# EAGLE design breakout board (EAGLE 9.7.0)
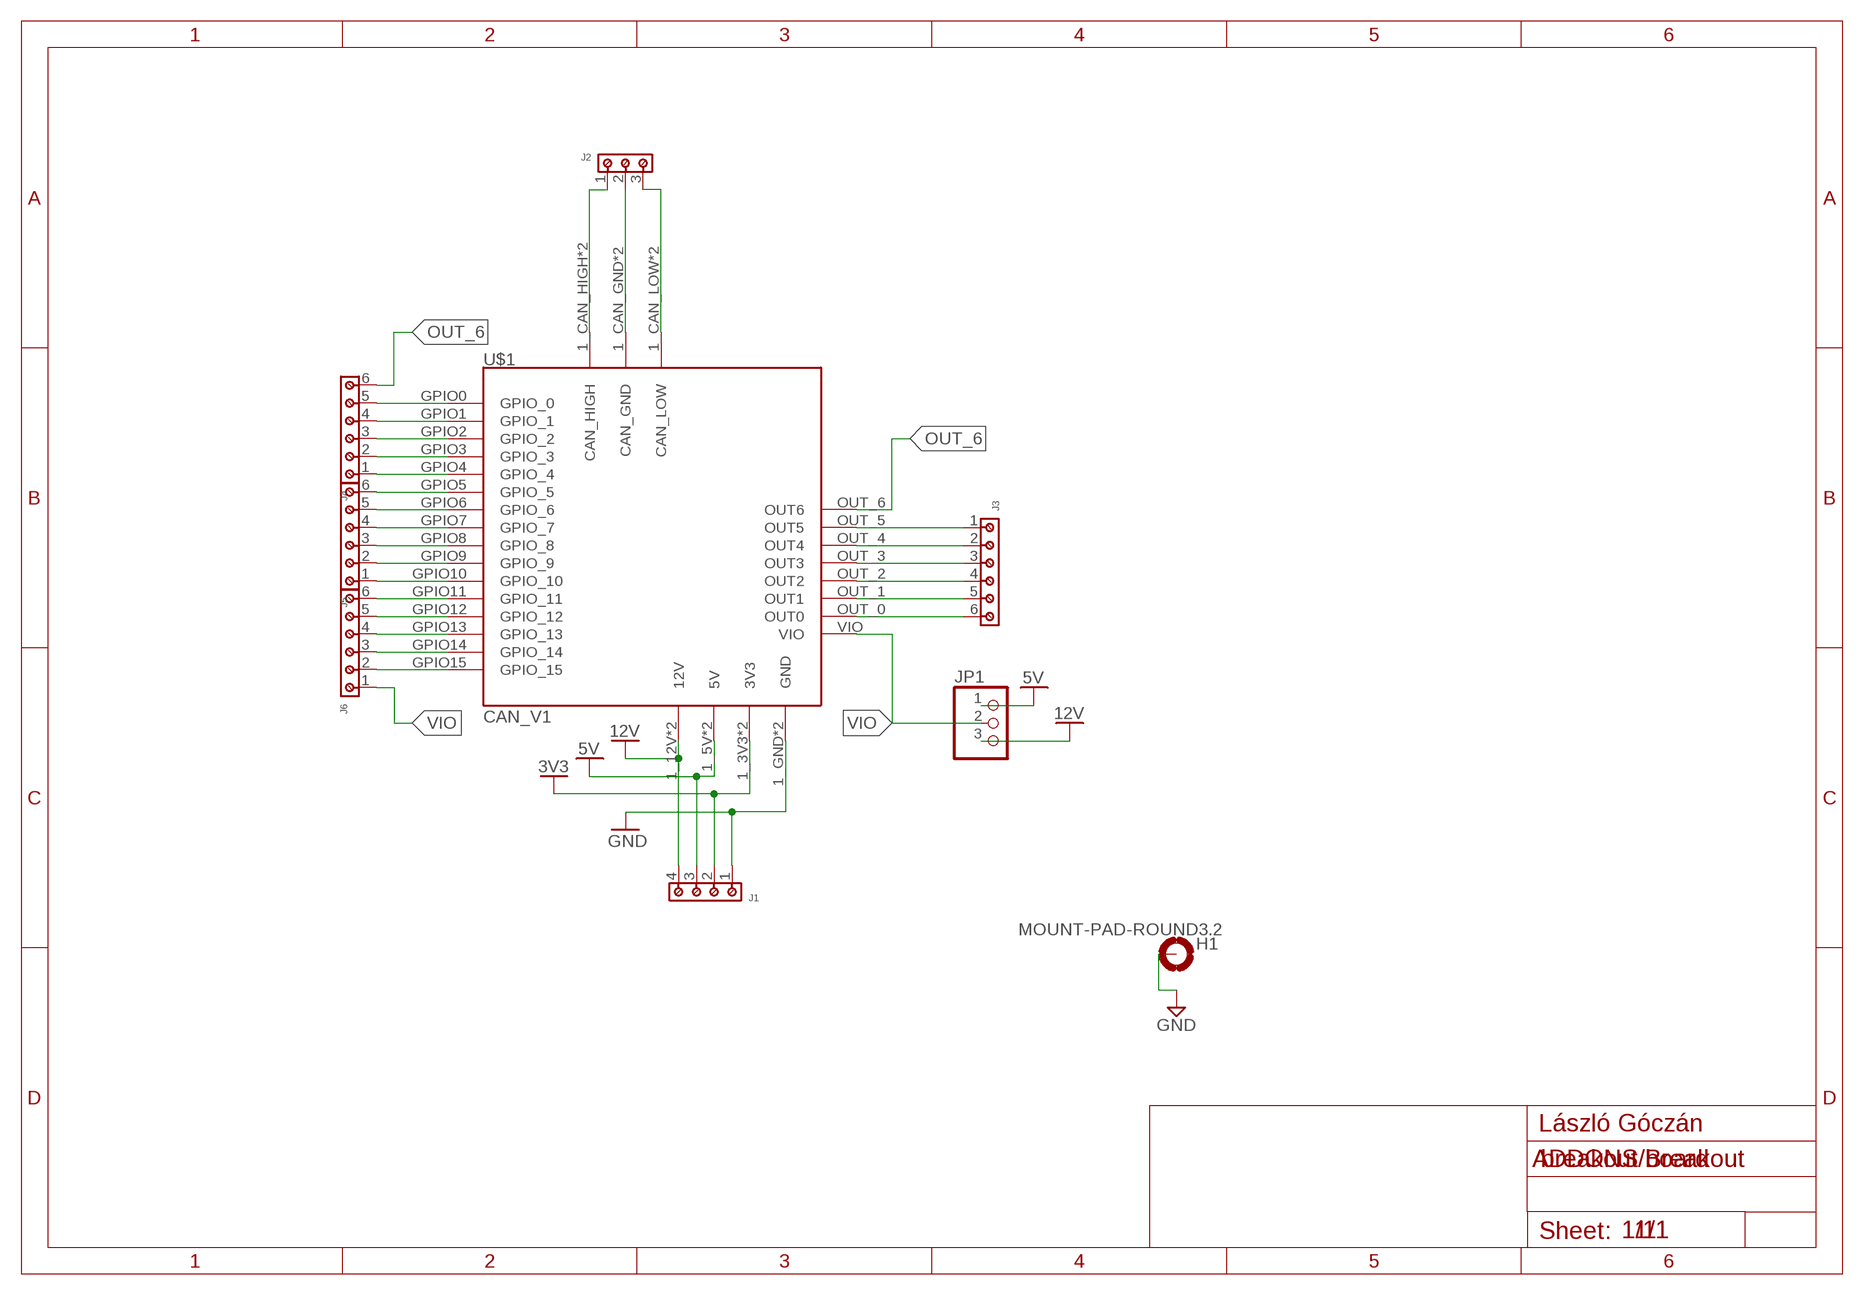
[diagram p0: schematic, sheet 1]

## Parts
H1  MOUNT-PAD-ROUND3.2  [3,2-PAD]
J1  691210910004  [691210910004]
J2  691210910003  [691210910003]
J3  691210910006  [691210910006]
J4  691210910006  [691210910006]
J5  691210910006  [691210910006]
J6  691210910006  [691210910006]
JP1  PINHD-1X3  [1X03]
U$1  CAN_V1  [CAN_V1]

## Nets
3V3: J1.2 U$1.1_3V3(3V3) U$1.2_3V3(3V3)
5V: J1.3 JP1.1 U$1.1_5V(5V) U$1.2_5V(5V)
12V: J1.4 JP1.3 U$1.1_12V(12V) U$1.2_12V(12V)
GND: H1.B3,2(MOUNT) J1.1 U$1.1_GND(GND) U$1.2_GND(GND)
N$1: J2.1 U$1.1_CAN_HIGH(CAN_HIGH) U$1.2_CAN_HIGH(CAN_HIGH)
N$2: J2.2 U$1.1_CAN_GND(CAN_GND) U$1.2_CAN_GND(CAN_GND)
N$3: J2.3 U$1.1_CAN_LOW(CAN_LOW) U$1.2_CAN_LOW(CAN_LOW)
N$4: J3.6 U$1.OUT_0(OUT0)
N$5: J3.5 U$1.OUT_1(OUT1)
N$6: J3.4 U$1.OUT_2(OUT2)
N$7: J3.3 U$1.OUT_3(OUT3)
N$8: J3.2 U$1.OUT_4(OUT4)
N$9: J3.1 U$1.OUT_5(OUT5)
N$10: J4.5 U$1.GPIO0(GPIO_0)
N$11: J4.4 U$1.GPIO1(GPIO_1)
N$12: J4.3 U$1.GPIO2(GPIO_2)
N$13: J4.2 U$1.GPIO3(GPIO_3)
N$14: J4.1 U$1.GPIO4(GPIO_4)
N$15: J5.6 U$1.GPIO5(GPIO_5)
N$16: J5.5 U$1.GPIO6(GPIO_6)
N$17: J5.4 U$1.GPIO7(GPIO_7)
N$18: J5.3 U$1.GPIO8(GPIO_8)
N$19: J5.2 U$1.GPIO9(GPIO_9)
N$20: J5.1 U$1.GPIO10(GPIO_10)
N$21: J6.6 U$1.GPIO11(GPIO_11)
N$22: J6.5 U$1.GPIO12(GPIO_12)
N$23: J6.4 U$1.GPIO13(GPIO_13)
N$24: J6.3 U$1.GPIO14(GPIO_14)
N$25: J6.2 U$1.GPIO15(GPIO_15)
OUT_6: J4.6 U$1.OUT_6(OUT6)
VIO: J6.1 JP1.2 U$1.VIO

## Notes on the sheet
- László Góczán
- ADDONS/Breakout
- 1/1

## Library data of the parts
H1 = holes:MOUNT-PAD-ROUND: MOUNTING PAD, round
J1 = Wurth_Connectors_WR-TBL Rising Cage Clamp:691210910004: WR-TBL Serie 2109 - 2.54 mm Horiz. Entry KIND PROPERTIES Pitch 2.54 mm MATERIAL PROPERTIES Insulator Material PA66 Insulator Flammability Rating UL94 V-0 Insulator Color Green Contact Material Brass Contact Plating Copper over Zinc Terminal Screw Material Steel Terminal Screw Plating Zinc Wire Guard Material Brass GENERAL INFORMATION Operating Temperature -40 up to +105 °C Compliance Lead free / RoHS ELECTRICAL PROPERTIES IR cULus 6 A Working Voltage [cULus] 150 V (AC) Withstanding Voltage [cULus] 1300 V (AC) Contact Resistance [cULus] 20 mΩ MECHANICAL PROPERTIES Wire Strip Length 4 up to 5 (mm) Screw M1.6 Solid Wire Section (AWG) 30 to 18 (AWG) Solid Wire Section (Metric) 0.0509 to 0.823 (mm²) Stranded Wire Section (AWG) 30 to 18 (AWG) Stranded Wire Section (Metric) 0.0509 to 0.823 (mm²) CERTIFICATION cULus Approval E315414 PACKAGING PROPERTIES Packaging Box <https://katalog.we-online.com/media/images/v2/o33231v209%20Family_WR-TBL_69121091000x.jpg> Details see: https://katalog.we-online.com/en/em/TBL_2_54_2109_HORIZONTAL_ENTRY_69121091000X Updated by Ella Wu 2019-11-12 2019(C) Wurth Elektronik; DATASHEET-URL: https://www.we-online.com/redexpert/spec/691210910004?ae; IR-UL: 6A; MOUNT: THT; PART-NUMBER: 691210910004; PINS: 4; PITCH: 2.54mm; TYPE: Horizontal; WIRE: 30 to 18 (AWG) 0.0509 to 0.823 (mm²); WORKING-VOLTAGE-UL: 150V (AC)
J2 = Wurth_Connectors_WR-TBL Rising Cage Clamp:691210910003: WR-TBL Serie 2109 - 2.54 mm Horiz. Entry KIND PROPERTIES Pitch 2.54 mm MATERIAL PROPERTIES Insulator Material PA66 Insulator Flammability Rating UL94 V-0 Insulator Color Green Contact Material Brass Contact Plating Copper over Zinc Terminal Screw Material Steel Terminal Screw Plating Zinc Wire Guard Material Brass GENERAL INFORMATION Operating Temperature -40 up to +105 °C Compliance Lead free / RoHS ELECTRICAL PROPERTIES IR cULus 6 A Working Voltage [cULus] 150 V (AC) Withstanding Voltage [cULus] 1300 V (AC) Contact Resistance [cULus] 20 mΩ MECHANICAL PROPERTIES Wire Strip Length 4 up to 5 (mm) Screw M1.6 Solid Wire Section (AWG) 30 to 18 (AWG) Solid Wire Section (Metric) 0.0509 to 0.823 (mm²) Stranded Wire Section (AWG) 30 to 18 (AWG) Stranded Wire Section (Metric) 0.0509 to 0.823 (mm²) CERTIFICATION cULus Approval E315414 PACKAGING PROPERTIES Packaging Box <https://katalog.we-online.com/media/images/v2/o33231v209%20Family_WR-TBL_69121091000x.jpg> Details see: https://katalog.we-online.com/en/em/TBL_2_54_2109_HORIZONTAL_ENTRY_69121091000X Updated by Ella Wu 2019-11-12 2019(C) Wurth Elektronik; DATASHEET-URL: https://www.we-online.com/redexpert/spec/691210910003?ae; IR-UL: 6A; MOUNT: THT; PART-NUMBER: 691210910003; PINS: 3; PITCH: 2.54mm; TYPE: Horizontal; WIRE: 30 to 18 (AWG) 0.0509 to 0.823 (mm²); WORKING-VOLTAGE-UL: 150V (AC)
J3-J6 = Wurth_Connectors_WR-TBL Rising Cage Clamp:691210910006: WR-TBL Serie 2109 - 2.54 mm Horiz. Entry KIND PROPERTIES Pitch 2.54 mm MATERIAL PROPERTIES Insulator Material PA66 Insulator Flammability Rating UL94 V-0 Insulator Color Green Contact Material Brass Contact Plating Copper over Zinc Terminal Screw Material Steel Terminal Screw Plating Zinc Wire Guard Material Brass GENERAL INFORMATION Operating Temperature -40 up to +105 °C Compliance Lead free / RoHS ELECTRICAL PROPERTIES IR cULus 6 A Working Voltage [cULus] 150 V (AC) Withstanding Voltage [cULus] 1300 V (AC) Contact Resistance [cULus] 20 mΩ MECHANICAL PROPERTIES Wire Strip Length 4 up to 5 (mm) Screw M1.6 Solid Wire Section (AWG) 30 to 18 (AWG) Solid Wire Section (Metric) 0.0509 to 0.823 (mm²) Stranded Wire Section (AWG) 30 to 18 (AWG) Stranded Wire Section (Metric) 0.0509 to 0.823 (mm²) CERTIFICATION cULus Approval E315414 PACKAGING PROPERTIES Packaging Box <https://katalog.we-online.com/media/images/v2/o33231v209%20Family_WR-TBL_69121091000x.jpg> Details see: https://katalog.we-online.com/en/em/TBL_2_54_2109_HORIZONTAL_ENTRY_69121091000X Updated by Ella Wu 2019-11-12 2019(C) Wurth Elektronik; DATASHEET-URL: https://www.we-online.com/redexpert/spec/691210910006?ae; IR-UL: 6A; MOUNT: THT; PART-NUMBER: 691210910006; PINS: 6; PITCH: 2.54mm; TYPE: Horizontal; WIRE: 30 to 18 (AWG) 0.0509 to 0.823 (mm²); WORKING-VOLTAGE-UL: 150V (AC)
JP1 = Connector:PINHD-1X3: PIN HEADER; CATEGORY: Headers; DESCRIPTION: Header, Straight, 3 Position; MANUFACTURER: Generic; MPN: Generic; OPERATING_TEMPERATURE: Generic; PART_STATUS: Active; PITCH: 0.100" (2.54mm); ROHS_COMPLIANCE: Generic; SERIES: Generic; SUB-CATEGORY: Headers, Male Pins; TYPE: Board to Board or Cable, Unshrouded, Through Hole, Straight
U$1 = solar_component:CAN_V1

## Board
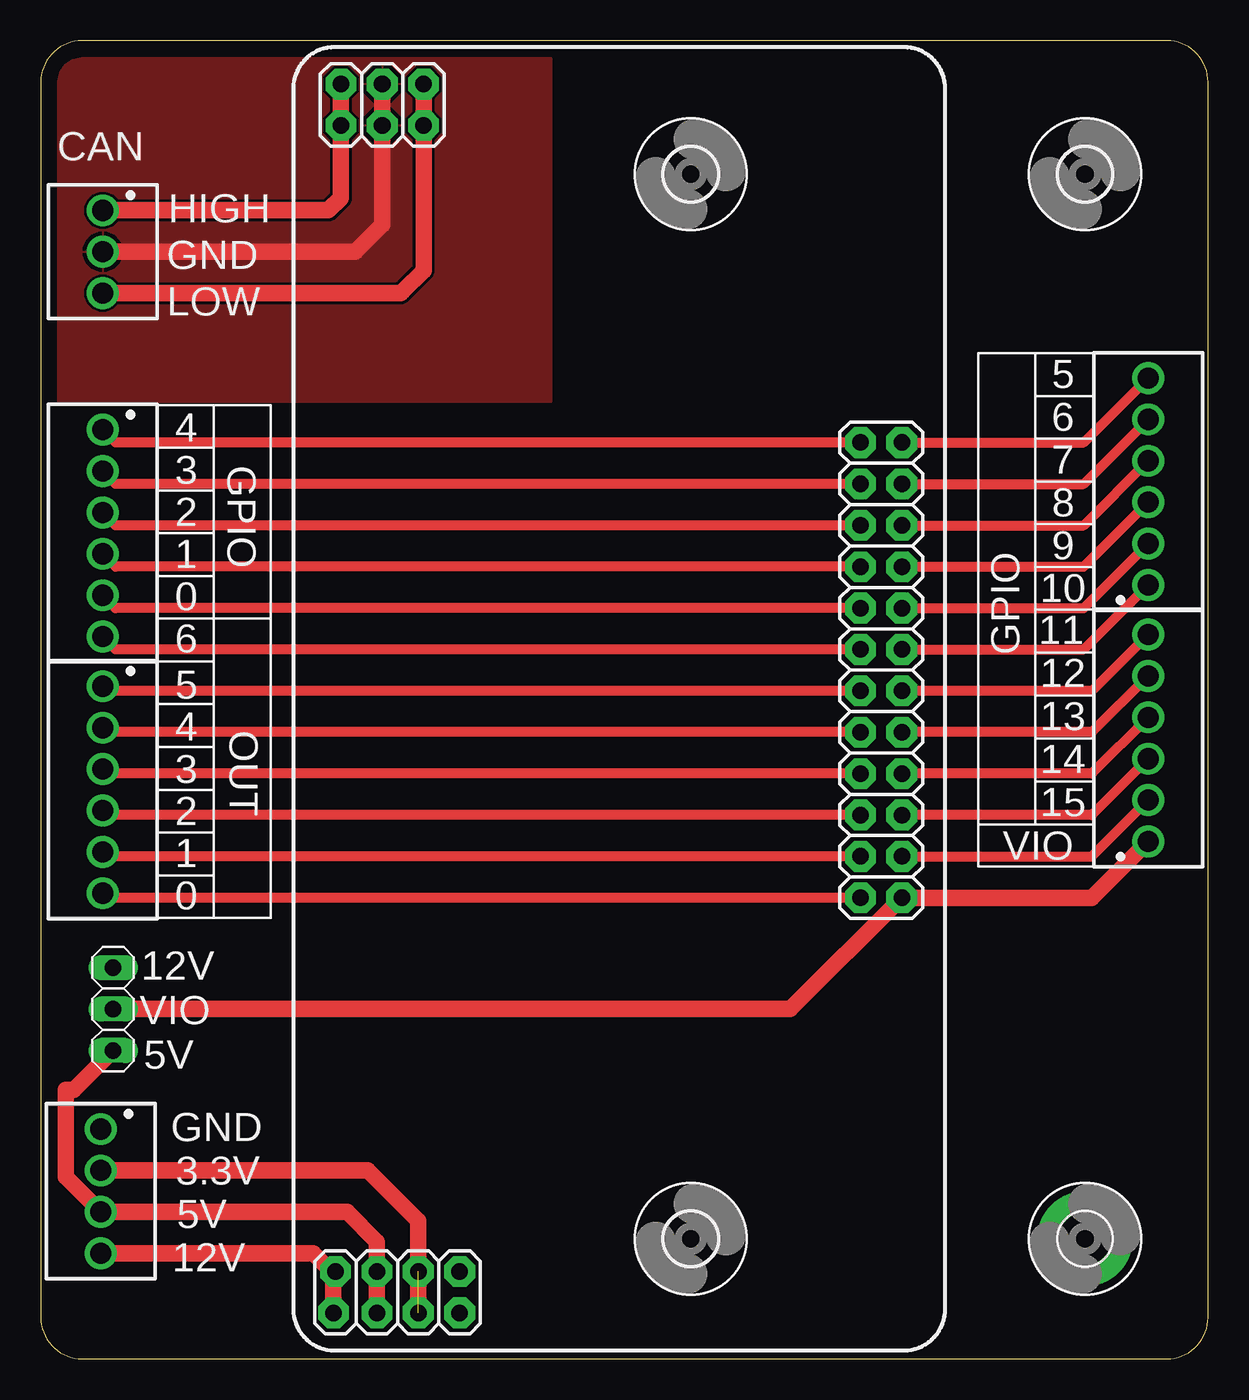
[diagram p1: board, top side]
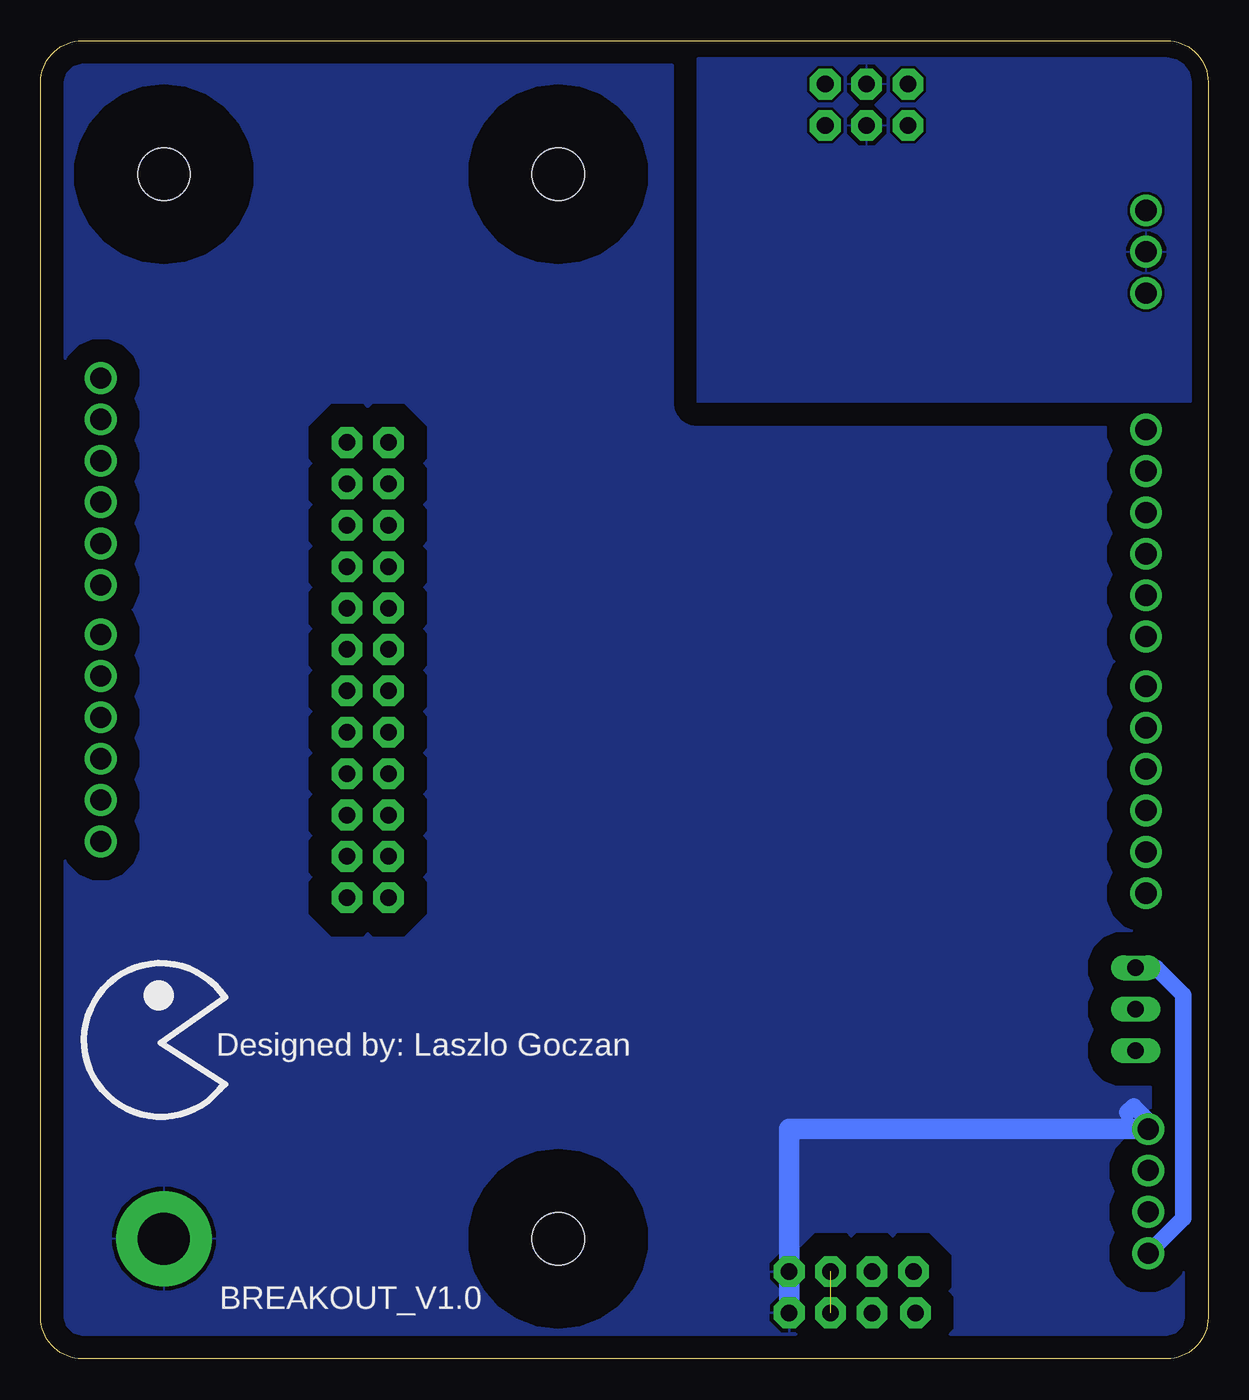
[diagram p2: board, bottom side, seen from below]

Size 71.63 x 80.9 mm. Coordinates in mm from the lower left corner, seen from the top.
Outline: 0,78.36 0,2.54 arc90 2.54,0 69.09,0 arc90 71.63,2.54 71.63,78.36 arc90 69.09,80.9 2.54,80.9 arc90 0,78.36
Copper layers (1*16): Top / Bottom
Stack-up Default Layer Stack: Top SilkScreen Epoxy Ink / Top SolderMask SR:Green 0.0254mm Dk 4.3 / Top Surface Finish Lead-Free 0.02mm / Top CuFoil:007 0.035mm / Dielectric-1 User Defined 1.5mm / Bottom CuFoil:007 0.035mm / Bottom Surface Finish Lead-Free 0.02mm / Bottom SolderMask SR:Green 0.0254mm Dk 4.3 / Bottom SilkScreen Epoxy Ink
Design rules: minimum copper width 6mil, minimum drill size 0.35mm, copper clearance wire_polygon to wire_polygon 6mil, copper clearance wire_polygon to pad_smd 6mil, copper clearance wire_polygon to via 6mil, copper clearance pad_smd to pad_smd 6mil, copper clearance pad_smd to via 6mil, copper clearance via to via 6mil, copper clearance smd to pad (same net) 6mil, copper clearance smd to via (same net) 6mil, copper clearance smd to smd (same net) 6mil, dimension clearance 40mil, via restrict clearance 0mil, restrict clearance 0mil, drill distance 6mil, keepout clearance 0mil

### Footprints (pad centres in the part's own frame; a part is rotated, then mirrored left to right if it is on the bottom)
3,2-PAD = drill 3.2 pad 5.842: B3,2 0,0
691210910004 = drill 1.3: 1 -3.81,0; 2 -1.27,0; 3 1.27,0; 4 3.81,0
691210910003 = drill 1.3: 1 -2.54,0; 2 0,0; 3 2.54,0
691210910006 = drill 1.3: 1 -6.35,0; 2 -3.81,0; 3 -1.27,0; 4 1.27,0; 5 3.81,0; 6 6.35,0
1X03 = drill 1.016 long: 1 -2.54,0; 2 0,0; 3 2.54,0
CAN_V1 = drill 1.016 pad 1.88 octagon: 1_3V3 7.671,4.851; 1_5V 5.131,4.851; 1_12V 2.591,4.851; 1_CAN_GND 5.461,75.184; 1_CAN_HIGH 2.921,75.184; 1_CAN_LOW 8.001,75.184; 1_GND 10.211,4.851; 2_3V3 7.671,2.311; 2_5V 5.131,2.311; 2_12V 2.464,2.311; 2_CAN_GND 5.461,77.724; 2_CAN_HIGH 2.921,77.724; 2_CAN_LOW 8.001,77.724; 2_GND 10.211,2.311; GPIO0 34.798,45.568; GPIO1 34.798,48.108; GPIO2 34.798,50.648; GPIO3 34.798,53.188; GPIO4 34.798,55.728; GPIO5 37.338,55.728; GPIO6 37.338,53.188; GPIO7 37.338,50.648; GPIO8 37.338,48.108; GPIO9 37.338,45.568; GPIO10 37.338,43.028; GPIO11 37.338,40.488; GPIO12 37.338,37.948; GPIO13 37.338,35.408; GPIO14 37.338,32.868; GPIO15 37.338,30.328; OUT_0 34.798,27.788; OUT_1 34.798,30.328; OUT_2 34.798,32.868; OUT_3 34.798,35.408; OUT_4 34.798,37.948; OUT_5 34.798,40.488; OUT_6 34.798,43.028; VIO 37.338,27.788
3,2 = hole 3.2: 0,0

### Placement (x,y rotation side)
H1  64.07,7.37 0 top
J1  3.68,10.29 270 top
J2  3.81,67.95 270 top
J3  3.81,34.93 270 top
J4  3.81,50.67 270 top
J5  67.94,53.85 90 top
J6  67.94,38.1 90 top
JP1  4.45,21.46 90 top
U$1  15.49,0.51 0 top
U$2  [3,2]  39.88,7.37 0 top
U$3  [3,2]  39.88,72.71 0 top
U$4  [3,2]  64.07,72.71 0 top

### Tracks (layer width: path | path; a pad name or v marks a point on that pad's centre or on a via)
3V3  (1 unrouted)
  Top 1.016: U$1.2_3V3 23.16,8.46 20.07,11.56 13.84,11.56 J1.2
5V
  Top 1.016: U$1.2_5V U$1.1_5V 20.62,7.19 18.8,9.02 J1.3 1.52,11.18 1.52,16.51 2.03,16.51 JP1.1
12V
  Top 1.016: U$1.2_12V 17.96,5.23 | 17.96,5.23 U$1.1_12V | J1.4 16.71,6.48 17.96,5.23
  Bottom 1.016: J1.4 1.52,8.64 1.52,22.33 3.19,24 JP1.3
GND
  Bottom 1.016: J1.1 3.68,14.61 4.57,15.49 4.95,15.11
  Bottom 1.27: J1.1 25.7,14.1 U$1.2_GND
  pour Bottom (isolate 1.422, rank 2): 74.8,85.47 74.8,-3.94 -10.41,-3.94 -10.41,86.74 -6.35,86.74
N$1
  Top 1.016: U$1.2_CAN_HIGH U$1.1_CAN_HIGH 18.41,71.25 17.65,70.48 J2.1
N$2
  Top 1.016: U$1.2_CAN_GND U$1.1_CAN_GND 20.95,69.6 19.3,67.95 J2.2
  pour Top: -1.52,83.44 -1.52,58.67 31.37,58.67 31.37,83.44
  pour Bottom: 31.37,83.44 -1.52,83.44 -1.52,58.67 31.37,58.67
N$3
  Top 1.016: U$1.2_CAN_LOW U$1.1_CAN_LOW 23.5,66.8 22.23,65.53 22.1,65.41 J2.3
N$4
  Top 0.61: U$1.OUT_0 4.09,28.3 J3.6
N$5
  Top 0.61: U$1.OUT_1 4.09,30.84 J3.5
N$6
  Top 0.61: U$1.OUT_2 4.09,33.38 J3.4
N$7
  Top 0.61: U$1.OUT_3 4.09,35.92 J3.3
N$8
  Top 0.61: U$1.OUT_4 4.09,38.46 J3.2
N$9
  Top 0.61: U$1.OUT_5 4.09,41 J3.1
N$10
  Top 0.61: U$1.GPIO0 4.6,46.08 J4.5
N$11
  Top 0.61: U$1.GPIO1 4.6,48.62 J4.4
N$12
  Top 0.61: U$1.GPIO2 4.6,51.16 J4.3
N$13
  Top 0.61: U$1.GPIO3 4.6,53.7 J4.2
N$14
  Top 0.61: U$1.GPIO4 4.6,56.24 J4.1
N$15
  Top 0.61: U$1.GPIO5 63.98,56.24 J5.6
N$16
  Top 0.61: U$1.GPIO6 63.98,53.7 J5.5
N$17
  Top 0.61: U$1.GPIO7 63.98,51.16 J5.4
N$18
  Top 0.61: U$1.GPIO8 63.98,48.62 J5.3
N$19
  Top 0.61: U$1.GPIO9 63.98,46.08 J5.2
N$20
  Top 0.61: U$1.GPIO10 63.98,43.54 J5.1
N$21
  Top 0.61: J6.6 64.49,41 U$1.GPIO11
N$22
  Top 0.61: J6.5 64.49,38.46 U$1.GPIO12
N$23
  Top 0.61: J6.4 64.49,35.92 U$1.GPIO13
N$24
  Top 0.61: J6.3 64.49,33.38 U$1.GPIO14
N$25
  Top 0.61: U$1.GPIO15 64.49,30.84 J6.2
OUT_6
  Top 0.61: U$1.OUT_6 4.6,43.54 J4.6
VIO
  Top 0.61: U$1.VIO 52.83,27.84
  Top 1.016: JP1.2 46,21.46 U$1.VIO 64.49,28.3 J6.1

### Text on the board
SilkscreenTop: CAN | HIGH | GND | LOW | 5 | 6 | 4 | 3 | 7 | 8 | 2 | GPIO | 1 | GPIO | 9 | 0 | 10 | 11 | 6 | 5 | 12 | 13 | 4 | 14 | 3 | 2 | OUT | 15 | VIO | 1 | 0 | 12V | VIO | 5V | GND | 3.3V | 5V | 12V
SilkscreenBottom: Designed by: Laszlo Goczan | BREAKOUT_V1.0